# Altium project Dong_ho_thoi_gian_thuc.PrjPcb
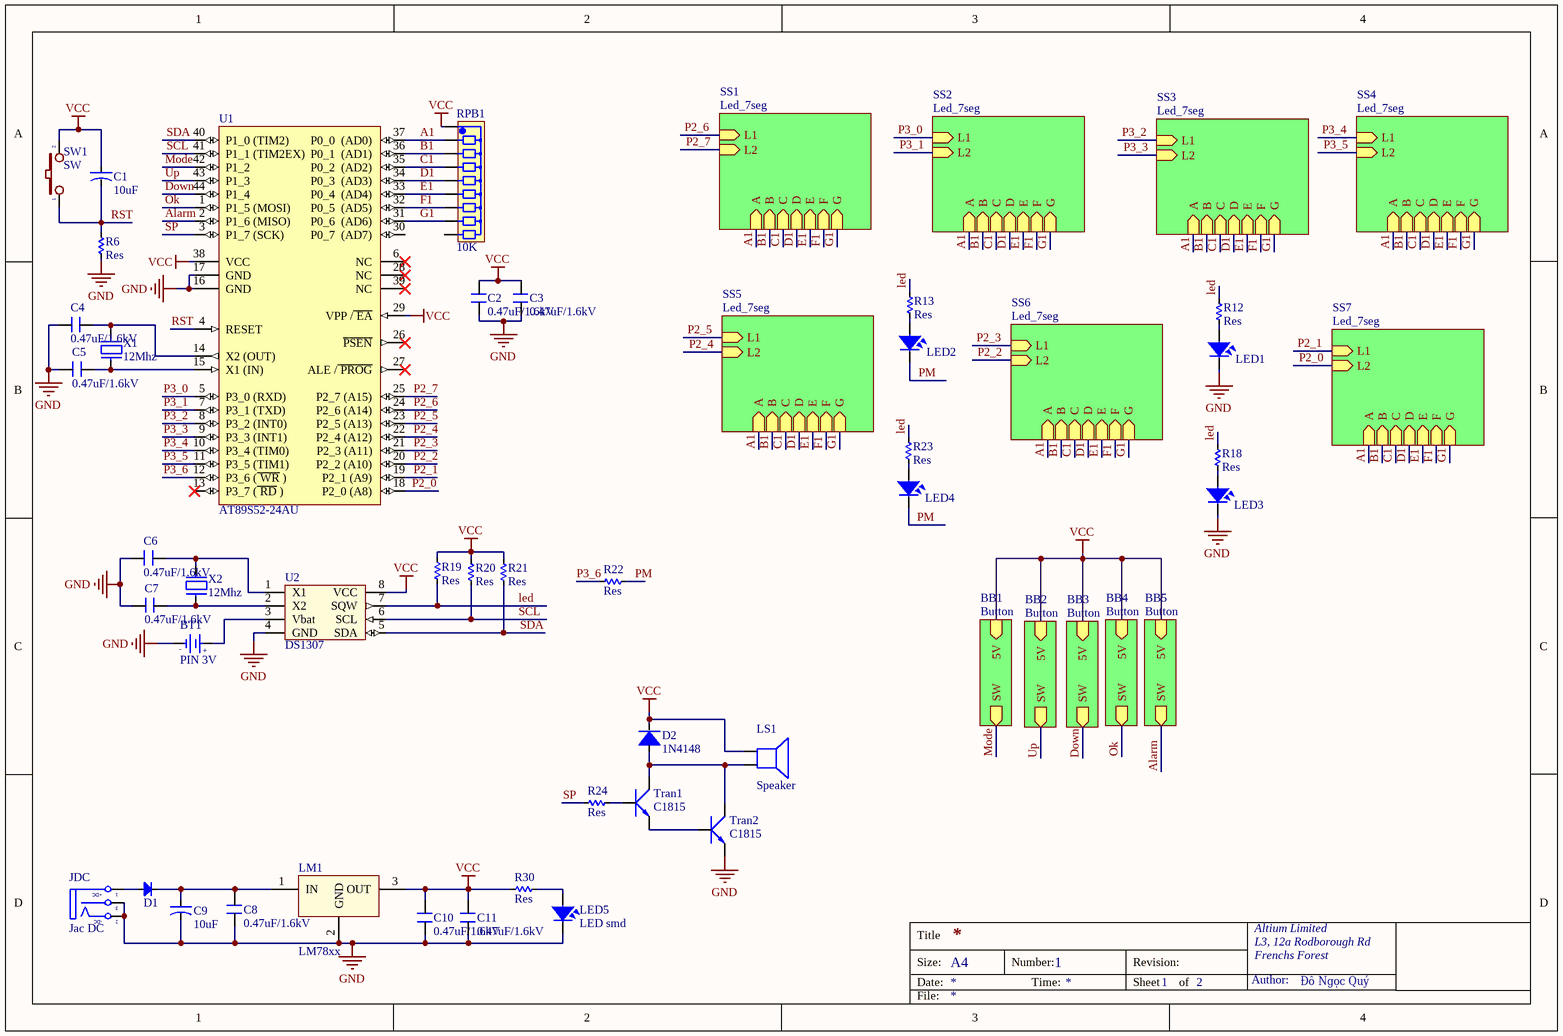
[diagram p0: Thoi_gian_thuc.SchDoc]
3 sheets, 91 parts. Net scope: hierarchical (ports join the sheet entries above them; power ports are global).
Board file: Thoi_gian_thuc.PcbDoc
Sheets:
  Thoi_gian_thuc.SchDoc
    SS1 = Led_7seg.SchDoc
    SS2 = Led_7seg.SchDoc
    SS3 = Led_7seg.SchDoc
    SS4 = Led_7seg.SchDoc
    SS5 = Led_7seg.SchDoc
    SS6 = Led_7seg.SchDoc
    SS7 = Led_7seg.SchDoc
    BB1 = Button.SchDoc
    BB2 = Button.SchDoc
    BB3 = Button.SchDoc
    BB4 = Button.SchDoc
    BB5 = Button.SchDoc

## Sheet Thoi_gian_thuc.SchDoc
size A4; Author: Đỗ Ngọc Quý; Organization: Altium Limited; Address1: L3, 12a Rodborough Rd; Address2: Frenchs Forest; Address3: NSW; Address4: Australia 2086; DocumentNumber: 1; SheetNumber: 1; SheetTotal: 2

### Parts
(Parts that share a designator on the sheet are numbered #1, #2 ... from top to bottom, then left to right.)
BT1  PIN 3V  [PIN CR1220-SMD]
C1  10uF  [CA-ALU-2.54]
C2  0.47uF/1.6kV  [cap 0805]
C3  0.47uF/1.6kV  [cap 0805]
C4  0.47uF/1.6kV  [cap 0805]
C5  0.47uF/1.6kV  [cap 0805]
C6  0.47uF/1.6kV  [cap 0805]
C7  0.47uF/1.6kV  [cap 0805]
C8  0.47uF/1.6kV  [cap 0805]
C9  10uF  [CA-ALU-2.54]
C10  0.47uF/1.6kV  [cap 0805]
C11  0.47uF/1.6kV  [cap 0805]
D1  Diode  [DIO-2A]  (value not drawn)
D2  1N4148  [SOD123]
JDC  Jac DC  [DC0]
LED1  LED  [LED-3MM-RED]  (value not drawn)
LED2  LED  [LED-3MM-RED]  (value not drawn)
LED3  LED  [LED-3MM-RED]  (value not drawn)
LED4  LED  [LED-3MM-RED]  (value not drawn)
LED5  LED smd  [LED-0805-Red]
LM1  LM78xx  [TO220-H3]
LS1  Speaker  [SPEAKER]
R6  Res  [RES-SMD-0805]
R12  Res  [RES-SMD-0805]
R13  Res  [RES-SMD-0805]
R18  Res  [RES-SMD-0805]
R19  Res  [RES-SMD-0805]
R20  Res  [RES-SMD-0805]
R21  Res  [RES-SMD-0805]
R22  Res  [RES-SMD-0805]
R23  Res  [RES-SMD-0805]
R24  Res  [RES-SMD-0805]
R30  Res  [RES-SMD-0805]
RPB1  10K  [RN8]
SW1#1  SW  [SW-SMD_apes]
Tran1  C1815  [C1815]
Tran2  C1815  [C1815]
U1  AT89S52-24AU  [TQFP44]
U2  DS1307  [DS1307 SMD]
X1  12Mhz  [XT2]
X2  12Mhz  [XT32k]

### Sub-sheets
BB1 = Button: 5V (in), SW (out)
BB2 = Button: 5V (in), SW (out)
BB3 = Button: 5V (in), SW (out)
BB4 = Button: 5V (in), SW (out)
BB5 = Button: 5V (in), SW (out)
SS1 = Led_7seg: L2 (in), L1 (in), C (in), G (in), F (in), A (in), D (in), E (in), B (in)
SS2 = Led_7seg: L2 (in), L1 (in), C (in), G (in), F (in), A (in), D (in), E (in), B (in)
SS3 = Led_7seg: L2 (in), L1 (in), C (in), G (in), F (in), A (in), D (in), E (in), B (in)
SS4 = Led_7seg: L2 (in), L1 (in), C (in), G (in), F (in), A (in), D (in), E (in), B (in)
SS5 = Led_7seg: L2 (in), L1 (in), C (in), G (in), F (in), A (in), D (in), E (in), B (in)
SS6 = Led_7seg: L2 (in), L1 (in), C (in), G (in), F (in), A (in), D (in), E (in), B (in)
SS7 = Led_7seg: L2 (in), L1 (in), C (in), G (in), F (in), A (in), D (in), E (in), B (in)

### Nets
GND: BT1.2(GND) C2.1 C3.1 C4.1 C5.1 C6.1 C7.1 C8.1 C9.2 C10.1 C11.1 JDC.2(TN) JDC.3(S) LED1.2 LED3.2 LED5.2 LM1.2(GND) R6.1 Tran2.2(E) U1.16(GND) U1.17(GND) U2.4(GND)
VCC: C1.1 C2.2 C3.2 C10.2 C11.2 D2.K LM1.3(OUT) LS1.1 R19.2 R20.2 R21.2 R30.2 RPB1.1 SW1#1.2 U1.29(VPP_/~{_EA}) U1.38(VCC) U2.8(VCC) ; sheet BB1/5V, sheet BB2/5V, sheet BB3/5V, sheet BB4/5V, sheet BB5/5V
A1: RPB1.2 U1.37(P0_0__(AD0)) ; sheet SS1/A, sheet SS2/A, sheet SS3/A, sheet SS4/A, sheet SS5/A, sheet SS6/A, sheet SS7/A
Alarm: U1.2(P1_6_(MISO)) ; sheet BB5/SW
B1: RPB1.3 U1.36(P0_1__(AD1)) ; sheet SS1/B, sheet SS2/B, sheet SS3/B, sheet SS4/B, sheet SS5/B, sheet SS6/B, sheet SS7/B
C1: RPB1.4 U1.35(P0_2__(AD2)) ; sheet SS1/C, sheet SS2/C, sheet SS3/C, sheet SS4/C, sheet SS5/C, sheet SS6/C, sheet SS7/C
D1: RPB1.5 U1.34(P0_3__(AD3)) ; sheet SS1/D, sheet SS2/D, sheet SS3/D, sheet SS4/D, sheet SS5/D, sheet SS6/D, sheet SS7/D
Down: U1.44(P1_4) ; sheet BB3/SW
E1: RPB1.6 U1.33(P0_4__(AD4)) ; sheet SS1/E, sheet SS2/E, sheet SS3/E, sheet SS4/E, sheet SS5/E, sheet SS6/E, sheet SS7/E
F1: RPB1.7 U1.32(P0_5__(AD5)) ; sheet SS1/F, sheet SS2/F, sheet SS3/F, sheet SS4/F, sheet SS5/F, sheet SS6/F, sheet SS7/F
G1: RPB1.8 U1.31(P0_6__(AD6)) ; sheet SS1/G, sheet SS2/G, sheet SS3/G, sheet SS4/G, sheet SS5/G, sheet SS6/G, sheet SS7/G
led: R12.1 R13.1 R18.1 R19.1 R23.1 U2.7(SQW)
Mode: U1.42(P1_2) ; sheet BB1/SW
Ok: U1.1(P1_5_(MOSI)) ; sheet BB4/SW
P2_0: U1.18(P2_0_(A8)) ; sheet SS7/L2
P2_1: U1.19(P2_1_(A9)) ; sheet SS7/L1
P2_2: U1.20(P2_2_(A10)) ; sheet SS6/L2
P2_3: U1.21(P2_3_(A11)) ; sheet SS6/L1
P2_4: U1.22(P2_4_(A12)) ; sheet SS5/L2
P2_5: U1.23(P2_5_(A13)) ; sheet SS5/L1
P2_6: U1.24(P2_6_(A14)) ; sheet SS1/L1
P2_7: U1.25(P2_7_(A15)) ; sheet SS1/L2
P3_0: U1.5(P3_0_(RXD)) ; sheet SS2/L1
P3_1: U1.7(P3_1_(TXD)) ; sheet SS2/L2
P3_2: U1.8(P3_2_(INT0)) ; sheet SS3/L1
P3_3: U1.9(P3_3_(INT1)) ; sheet SS3/L2
P3_4: U1.10(P3_4_(TIM0)) ; sheet SS4/L1
P3_5: U1.11(P3_5_(TIM1)) ; sheet SS4/L2
P3_6: R22.1 U1.12(P3_6_(~{_WR}_))
PM: LED2.2 LED4.2 R22.2
RST: C1.2 R6.2 SW1#1.1 U1.4(RESET)
SCL: R20.1 U1.41(P1_1_(TIM2EX)) U2.6(SCL)
SDA: R21.1 U1.40(P1_0_(TIM2)) U2.5(SDA)
SP: R24.2 U1.3(P1_7_(SCK))
Up: U1.43(P1_3) ; sheet BB2/SW
NetBT1_1: BT1.1(+3V) U2.3(Vbat)
NetC4_2: C4.2 U1.14(X2_(OUT)) X1.2
NetC5_2: C5.2 U1.15(X1_(IN)) X1.1
NetC6_2: C6.2 U2.1(X1) X2.2
NetC7_2: C7.2 U2.2(X2) X2.1
NetC8_2: C8.2 C9.1 D1.2(K) LM1.1(IN)
NetD1_1: D1.1(A) JDC.1(T)
NetD2_A: D2.A LS1.2 Tran1.3(C) Tran2.3(C)
NetLED1_1: LED1.1 R12.2
NetLED2_1: LED2.1 R13.2
NetLED3_1: LED3.1 R18.2
NetLED4_1: LED4.1 R23.2
NetLED5_1: LED5.1 R30.1
NetR24_1: R24.1 Tran1.1(B)
NetTran1_2: Tran1.2(E) Tran2.1(B)

Not connected (* = marked no-connect by the designer): RPB1 9; U1 6(NC)* 13(P3_7_(~{_RD}_))* 26(~{PSEN})* 27(ALE_/~{_PROG})* 28(NC)* 30(P0_7__(AD7)) 39(NC)*

### Notes on the sheet
- Title
- Size:
- Date:
- A4
- Number:
- Time:
- Revision:
- Sheet
- of
- Author:
- File:
- (in symbol DCIN) +DC; -DC
- (in symbol PIN 3V) -; +

### Library data of the parts
BT1 = PIN 3V: Battery 3VDC; Value: PIN 3V
C1 C9 = CN-ALU-DIP: Capacitor (Semiconductor SIM Model); Value: 104; LatestRevisionDate: 17-Jul-2002; LatestRevisionNote: Re-released for DXP Platform.; PackageReference: C1206; Publisher: Altium Limited
C2-C8 C10 C11 = Cap
D1 = Diode: Default Diode; Code - JEDEC: DO-214-AB; Value: 1N5007; Published: 8-Jun-2000; Revision: July-2002: Re-released for DXP Platform.; Publisher: Altium Limited
D2 = Diode 1N4148
JDC = DCIN: Jac DC input; Value: Jac DC
LED1-LED4 = LED: LED Single colour Green and Red; Value: LED 3 ly Single Colour
LS1 = Speaker: Loudspeaker; Published: 24-Mar-1999; LatestRevisionDate: 17-Jul-2002; LatestRevisionNote: Re-released for DXP Platform.; PackageReference: PIN2; Publisher: Altium Limited
R6 R12 R13 R18-R24 R30 = Res-SMD: Resistor; Manufacturer: Generic Components; Class: Passive; Published: 08/06/2000; Publisher: Altium Hobart Technology Centre
RPB1 = RN8: Resistor 8 (Thanh); Value: Tro thanh 10K
SW1#1 = SW2: Switch button 2 pin; Value: SW chip 2 pin
U1 = AT89S52-24AU: Atmel 8 Bit Micro 4.0-5.5V 24MHz -40 to +80 Deg C 44TQFP (44A) Package GREEN OPTION; GREEN OPTION: YES; Vendor: ATMEL; PartNr: AT89S52-24AU; Package: 44A 44-lead, Thin Plastic Gull Wing Quad Flatpack (TQFP)
X1 X2 = XT2_1: Crystal, 32.768 KHz, -40 to 85 degC, 3.2 x 1.5 x 0.9 mm SMD; Value: 4Mhz

## Sheet Led_7seg.SchDoc
size A4; Author: Đỗ Ngọc Quý; Organization: Altium Limited; Address1: L3, 12a Rodborough Rd; Address2: Frenchs Forest; Address3: NSW; Address4: Australia 2086; DocumentNumber: 2; SheetNumber: 2; SheetTotal: 2
Used 7 times, as channels SS1, SS2, SS3, SS4, SS5, SS6, SS7. Parts and nets are listed once, with the designators drawn on the sheet.
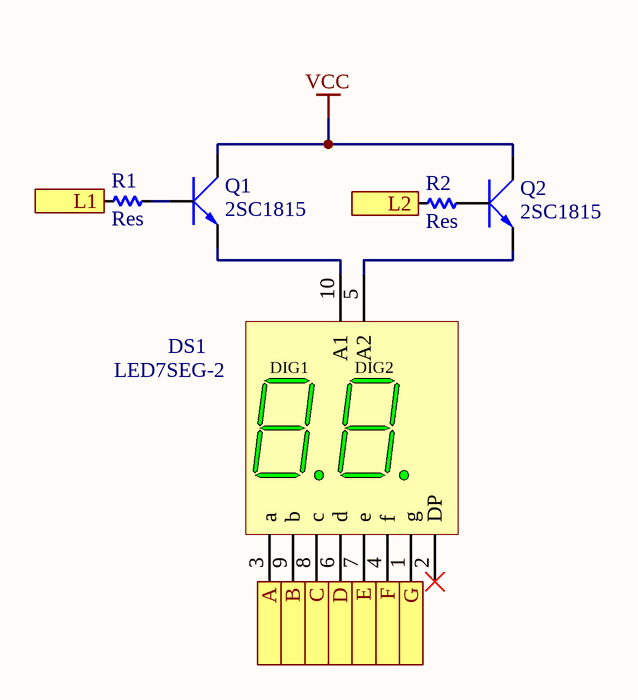
[diagram p1: Led_7seg.SchDoc]

### Parts
DS1  LED7SEG-2  [LED7SEG-2-0.36]
Q1  2SC1815  [SOT23-321]
Q2  2SC1815  [SOT23-321]
R1  Res  [RES-SMD-0101]
R2  Res  [RES-SMD-0101]

### Ports
A (in), B (in), C (in), D (in), E (in), F (in), G (in), L1 (in), L2 (in)

### Nets
VCC: Q1.2(C) Q2.2(C)
A: DS1.3(a) ; port A
B: DS1.9(b) ; port B
C: DS1.8(c) ; port C
D: DS1.6(d) ; port D
E: DS1.7(e) ; port E
F: DS1.4(f) ; port F
G: DS1.1(g) ; port G
L1: R1.1 ; port L1
L2: R2.1 ; port L2
NetDS1_5: DS1.5(A2) Q2.1(E)
NetDS1_10: DS1.10(A1) Q1.1(E)
NetQ1_3: Q1.3(B) R1.2
NetQ2_3: Q2.3(B) R2.2

Not connected (* = marked no-connect by the designer): DS1 2(DP)*

### Channels
SS1: designators DS1=THỨ Q1=Q1_SS1 Q2=Q2_SS1 R1=R1_SS1 R2=R2_SS1; ports A=A1 B=B1 C=C1 D=D1 E=E1 F=F1 G=G1 L1=P2_6 L2=P2_7
SS2: designators DS1=NGÀY Q1=Q1_SS2 Q2=Q2_SS2 R1=R1_SS2 R2=R2_SS2; ports A=A1 B=B1 C=C1 D=D1 E=E1 F=F1 G=G1 L1=P3_0 L2=P3_1
SS3: designators DS1=THÁNG Q1=Q1_SS3 Q2=Q2_SS3 R1=R1_SS3 R2=R2_SS3; ports A=A1 B=B1 C=C1 D=D1 E=E1 F=F1 G=G1 L1=P3_2 L2=P3_3
SS4: designators DS1=NĂM Q1=Q1_SS4 Q2=Q2_SS4 R1=R1_SS4 R2=R2_SS4; ports A=A1 B=B1 C=C1 D=D1 E=E1 F=F1 G=G1 L1=P3_4 L2=P3_5
SS5: designators DS1=GIỜ Q1=Q1_SS5 Q2=Q2_SS5 R1=R1_SS5 R2=R2_SS5; ports A=A1 B=B1 C=C1 D=D1 E=E1 F=F1 G=G1 L1=P2_5 L2=P2_4
SS6: designators DS1=PHÚT Q1=Q1_SS6 Q2=Q2_SS6 R1=R1_SS6 R2=R2_SS6; ports A=A1 B=B1 C=C1 D=D1 E=E1 F=F1 G=G1 L1=P2_3 L2=P2_2
SS7: designators DS1=GIÂY Q1=Q1_SS7 Q2=Q2_SS7 R1=R1_SS7 R2=R2_SS7; ports A=A1 B=B1 C=C1 D=D1 E=E1 F=F1 G=G1 L1=P2_1 L2=P2_0

### Notes on the sheet
- Title
- Size:
- Date:
- A4
- Number:
- Time:
- Revision:
- Sheet
- of
- Author:
- File:
- (in symbol LED7SEG-2) DIG1; DIG2

### Library data of the parts
DS1 = LED7SEG-2: 9.2 mm Green 7-Segment Display: 2-Digit, RH DP; Published: 26-May-2004; LatestRevisionDate: 11-Oct-2004; LatestRevisionNote: Display outline superimposed on PCB Footprint.; DatasheetVersion: 14-Mar-2003; PackageVersion: 14-Mar-2003; PackageReference: HDSM-577; Publisher: Altium Limited; PackageDescription: LED, 7-Segment Display, 9.2 mm, Dual Digit; 10 Leads; Row Space 10.7 mm; Pitch 2.54 mm; ComponentLink1Description: Manufacturer Link; ComponentLink1URL: http://www.avagotech.com/
Q1 Q2 = 2SC1815: NPN 600mW, ECB; Value: C1815
R1 R2 = Res-SMD: as R6 on sheet Thoi_gian_thuc; Published: 08/06/2000; Publisher: Altium Hobart Technology Centre

## Sheet Button.SchDoc
size A4; Author: Đỗ Ngọc Quý; Organization: Altium Limited; Address1: L3, 12a Rodborough Rd; Address2: Frenchs Forest; Address3: NSW; Address4: Australia 2086
Used 5 times, as channels BB1, BB2, BB3, BB4, BB5. Parts and nets are listed once, with the designators drawn on the sheet.
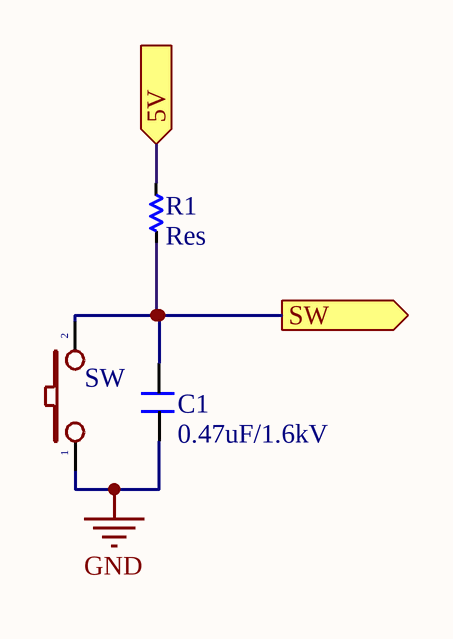
[diagram p2: Button.SchDoc]

### Parts
C1  0.47uF/1.6kV  [cap 0805]
R1  Res  [RES-SMD-0101]
  SW  [SW-SMD_apes]

### Ports
5V (in), SW (out)

### Nets
GND: C1.1 .1
5V: R1.1 ; port 5V
SW: C1.2 R1.2 .2 ; port SW

### Channels
BB1: designators  =SW1_BB1 C1=C1_BB1 R1=R1_BB1; ports 5V=VCC SW=Mode
BB2: designators  =SW1_BB2 C1=C1_BB2 R1=R1_BB2; ports 5V=VCC SW=Up
BB3: designators  =SW1#2 C1=C1_BB3 R1=R1_BB3; ports 5V=VCC SW=Down
BB4: designators  =SW1_BB4 C1=C1_BB4 R1=R1_BB4; ports 5V=VCC SW=Ok
BB5: designators  =SW1_BB5 C1=C1_BB5 R1=R1_BB5; ports 5V=VCC SW=Alarm

### Notes on the sheet
- Title
- Size:
- Date:
- A4
- Number:
- Time:
- Revision:
- Sheet
- of
- Author:
- File:

### Library data of the parts
C1 = Cap
R1 = Res-SMD: as R6 on sheet Thoi_gian_thuc; Published: 08/06/2000; Publisher: Altium Hobart Technology Centre
 = SW2: as SW1#1 on sheet Thoi_gian_thuc

## Nets that join several sheets
GND: Thoi_gian_thuc (22 pins), BB1 (C1_BB1.1 SW1_BB1.1), BB2 (C1_BB2.1 SW1_BB2.1), BB3 (C1_BB3.1 SW1#2.1), BB4 (C1_BB4.1 SW1_BB4.1), BB5 (C1_BB5.1 SW1_BB5.1)
VCC: Thoi_gian_thuc (17 pins), SS1 (Q1_SS1.2 Q2_SS1.2), SS2 (Q1_SS2.2 Q2_SS2.2), SS3 (Q1_SS3.2 Q2_SS3.2), SS4 (Q1_SS4.2 Q2_SS4.2), SS5 (Q1_SS5.2 Q2_SS5.2), SS6 (Q1_SS6.2 Q2_SS6.2), SS7 (Q1_SS7.2 Q2_SS7.2), BB1 (R1_BB1.1), BB2 (R1_BB2.1), BB3 (R1_BB3.1), BB4 (R1_BB4.1), BB5 (R1_BB5.1)
A1: Thoi_gian_thuc (RPB1.2 U1.37), SS1 (THỨ.3), SS2 (NGÀY.3), SS3 (THÁNG.3), SS4 (NĂM.3), SS5 (GIỜ.3), SS6 (PHÚT.3), SS7 (GIÂY.3)
Alarm: Thoi_gian_thuc (U1.2), BB5 (C1_BB5.2 R1_BB5.2 SW1_BB5.2)
B1: Thoi_gian_thuc (RPB1.3 U1.36), SS1 (THỨ.9), SS2 (NGÀY.9), SS3 (THÁNG.9), SS4 (NĂM.9), SS5 (GIỜ.9), SS6 (PHÚT.9), SS7 (GIÂY.9)
C1: Thoi_gian_thuc (RPB1.4 U1.35), SS1 (THỨ.8), SS2 (NGÀY.8), SS3 (THÁNG.8), SS4 (NĂM.8), SS5 (GIỜ.8), SS6 (PHÚT.8), SS7 (GIÂY.8)
D1: Thoi_gian_thuc (RPB1.5 U1.34), SS1 (THỨ.6), SS2 (NGÀY.6), SS3 (THÁNG.6), SS4 (NĂM.6), SS5 (GIỜ.6), SS6 (PHÚT.6), SS7 (GIÂY.6)
Down: Thoi_gian_thuc (U1.44), BB3 (C1_BB3.2 R1_BB3.2 SW1#2.2)
E1: Thoi_gian_thuc (RPB1.6 U1.33), SS1 (THỨ.7), SS2 (NGÀY.7), SS3 (THÁNG.7), SS4 (NĂM.7), SS5 (GIỜ.7), SS6 (PHÚT.7), SS7 (GIÂY.7)
F1: Thoi_gian_thuc (RPB1.7 U1.32), SS1 (THỨ.4), SS2 (NGÀY.4), SS3 (THÁNG.4), SS4 (NĂM.4), SS5 (GIỜ.4), SS6 (PHÚT.4), SS7 (GIÂY.4)
G1: Thoi_gian_thuc (RPB1.8 U1.31), SS1 (THỨ.1), SS2 (NGÀY.1), SS3 (THÁNG.1), SS4 (NĂM.1), SS5 (GIỜ.1), SS6 (PHÚT.1), SS7 (GIÂY.1)
Mode: Thoi_gian_thuc (U1.42), BB1 (C1_BB1.2 R1_BB1.2 SW1_BB1.2)
Ok: Thoi_gian_thuc (U1.1), BB4 (C1_BB4.2 R1_BB4.2 SW1_BB4.2)
P2_0: Thoi_gian_thuc (U1.18), SS7 (R2_SS7.1)
P2_1: Thoi_gian_thuc (U1.19), SS7 (R1_SS7.1)
P2_2: Thoi_gian_thuc (U1.20), SS6 (R2_SS6.1)
P2_3: Thoi_gian_thuc (U1.21), SS6 (R1_SS6.1)
P2_4: Thoi_gian_thuc (U1.22), SS5 (R2_SS5.1)
P2_5: Thoi_gian_thuc (U1.23), SS5 (R1_SS5.1)
P2_6: Thoi_gian_thuc (U1.24), SS1 (R1_SS1.1)
P2_7: Thoi_gian_thuc (U1.25), SS1 (R2_SS1.1)
P3_0: Thoi_gian_thuc (U1.5), SS2 (R1_SS2.1)
P3_1: Thoi_gian_thuc (U1.7), SS2 (R2_SS2.1)
P3_2: Thoi_gian_thuc (U1.8), SS3 (R1_SS3.1)
P3_3: Thoi_gian_thuc (U1.9), SS3 (R2_SS3.1)
P3_4: Thoi_gian_thuc (U1.10), SS4 (R1_SS4.1)
P3_5: Thoi_gian_thuc (U1.11), SS4 (R2_SS4.1)
Up: Thoi_gian_thuc (U1.43), BB2 (C1_BB2.2 R1_BB2.2 SW1_BB2.2)